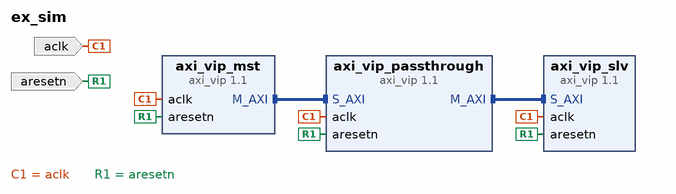
[diagram p0: block diagram of the top level]
# Vivado block design ex_sim, xczu19eg-ffvc1760-2-i, Vivado 2024.2
create_bd_design ex_sim

create_bd_port -dir I -type clk aclk
set_property -dict [list \
  CONFIG.CLK_DOMAIN design_sim_clk_wiz_0_0_clk_out1 \
  CONFIG.FREQ_HZ 300000000 \
  CONFIG.PHASE 0.0 \
] [get_bd_ports aclk]
create_bd_port -dir I -type rst aresetn
set_property -dict {CONFIG.POLARITY ACTIVE_LOW} [get_bd_ports aresetn]

create_bd_cell -type ip -vlnv xilinx.com:ip:axi_vip:1.1 axi_vip_mst
set_property -dict [list \
  CONFIG.ADDR_WIDTH 64 \
  CONFIG.ARUSER_WIDTH 0 \
  CONFIG.AWUSER_WIDTH 0 \
  CONFIG.BUSER_WIDTH 0 \
  CONFIG.DATA_WIDTH 64 \
  CONFIG.HAS_ACLKEN 0 \
  CONFIG.HAS_ARESETN 1 \
  CONFIG.HAS_BRESP 1 \
  CONFIG.HAS_BURST 1 \
  CONFIG.HAS_CACHE 1 \
  CONFIG.HAS_LOCK 1 \
  CONFIG.HAS_PROT 1 \
  CONFIG.HAS_QOS 1 \
  CONFIG.HAS_REGION 1 \
  CONFIG.HAS_RRESP 1 \
  CONFIG.HAS_SIZE 0 \
  CONFIG.HAS_USER_BITS_PER_BYTE 0 \
  CONFIG.HAS_WSTRB 1 \
  CONFIG.ID_WIDTH 0 \
  CONFIG.INTERFACE_MODE MASTER \
  CONFIG.PROTOCOL AXI4 \
  CONFIG.READ_WRITE_MODE READ_WRITE \
  CONFIG.RUSER_WIDTH 0 \
  CONFIG.SUPPORTS_NARROW 1 \
  CONFIG.WUSER_WIDTH 0 \
] [get_bd_cells axi_vip_mst]
create_bd_cell -type ip -vlnv xilinx.com:ip:axi_vip:1.1 axi_vip_passthrough
set_property -dict {CONFIG.HAS_ACLKEN 0 CONFIG.HAS_ARESETN 1} [get_bd_cells axi_vip_passthrough]
create_bd_cell -type ip -vlnv xilinx.com:ip:axi_vip:1.1 axi_vip_slv
set_property -dict [list \
  CONFIG.ADDR_WIDTH 64 \
  CONFIG.DATA_WIDTH 64 \
  CONFIG.HAS_ACLKEN 0 \
  CONFIG.HAS_ARESETN 1 \
  CONFIG.HAS_SIZE 0 \
  CONFIG.INTERFACE_MODE SLAVE \
  CONFIG.PROTOCOL AXI4 \
  CONFIG.READ_WRITE_MODE READ_WRITE \
] [get_bd_cells axi_vip_slv]

# ---- connections ----

connect_bd_intf_net [get_bd_intf_pins axi_vip_passthrough/S_AXI] [get_bd_intf_pins axi_vip_mst/M_AXI]
connect_bd_intf_net [get_bd_intf_pins axi_vip_slv/S_AXI] [get_bd_intf_pins axi_vip_passthrough/M_AXI]
connect_bd_net [get_bd_ports aclk] [get_bd_pins axi_vip_mst/aclk] [get_bd_pins axi_vip_passthrough/aclk] [get_bd_pins axi_vip_slv/aclk]
connect_bd_net [get_bd_ports aresetn] [get_bd_pins axi_vip_mst/aresetn] [get_bd_pins axi_vip_passthrough/aresetn] [get_bd_pins axi_vip_slv/aresetn]

# ---- address map ----
assign_bd_address -offset 0x0000000044A00000 -range 64K -target_address_space [get_bd_addr_spaces axi_vip_mst/Master_AXI] [get_bd_addr_segs axi_vip_slv/S_AXI/Reg]

validate_bd_design
save_bd_design
